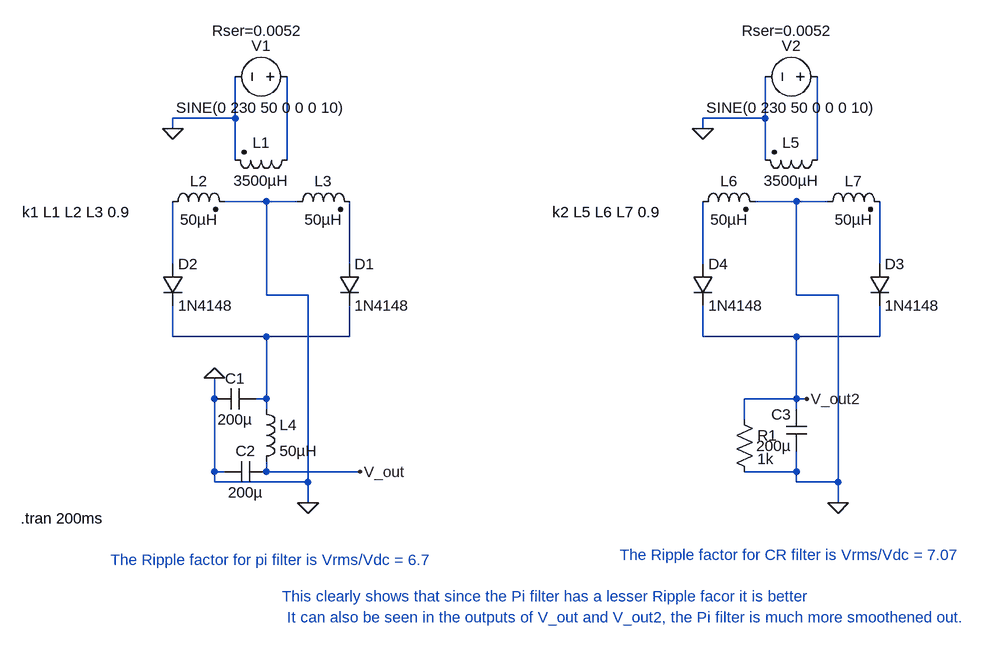
[diagram p0: schematic centertap_fullwave_rectifier_2019A3PS0443H.asc]
centertap_fullwave_rectifier_2019A3PS0443H.asc, the LTspice schematic file:
Version 4
SHEET 1 1320 720
WIRE 96 -64 96 -128
WIRE 96 -64 0 -64
WIRE 912 -64 912 -128
WIRE 912 -64 816 -64
WIRE 0 -48 0 -64
WIRE 816 -48 816 -64
WIRE 96 0 96 -64
WIRE 176 0 176 -128
WIRE 912 0 912 -64
WIRE 992 0 992 -128
WIRE 144 64 80 64
WIRE 192 64 144 64
WIRE 960 64 896 64
WIRE 1008 64 960 64
WIRE 0 160 0 64
WIRE 272 160 272 64
WIRE 816 160 816 64
WIRE 1088 160 1088 64
WIRE 144 208 144 64
WIRE 208 208 144 208
WIRE 960 208 960 64
WIRE 1024 208 960 208
WIRE 0 272 0 224
WIRE 144 272 0 272
WIRE 272 272 272 224
WIRE 272 272 144 272
WIRE 816 272 816 224
WIRE 960 272 816 272
WIRE 1088 272 1088 224
WIRE 1088 272 960 272
WIRE 64 368 64 336
WIRE 144 368 144 272
WIRE 144 368 128 368
WIRE 960 368 960 272
WIRE 960 368 880 368
WIRE 976 368 960 368
WIRE 144 384 144 368
WIRE 960 384 960 368
WIRE 880 400 880 368
WIRE 64 480 64 368
WIRE 80 480 64 480
WIRE 144 480 144 464
WIRE 288 480 144 480
WIRE 960 480 960 448
WIRE 960 480 880 480
WIRE 64 496 64 480
WIRE 208 496 208 208
WIRE 208 496 64 496
WIRE 960 496 960 480
WIRE 1024 496 1024 208
WIRE 1024 496 960 496
WIRE 208 528 208 496
WIRE 1024 528 1024 496
FLAG 208 528 0
FLAG 0 -48 0
FLAG 64 336 0
FLAG 288 480 V_out
FLAG 1024 528 0
FLAG 816 -48 0
FLAG 976 368 V_out2
SYMBOL ind2 192 -16 R90
WINDOW 0 5 56 VBottom 2
WINDOW 3 32 56 VTop 2
SYMATTR InstName L1
SYMATTR Value 3500µH
SYMATTR Type ind
SYMBOL ind2 -16 80 R270
WINDOW 0 32 56 VTop 2
WINDOW 3 4 56 VBottom 2
SYMATTR InstName L2
SYMATTR Value 50µH
SYMATTR Type ind
SYMBOL ind2 176 80 R270
WINDOW 0 32 56 VTop 2
WINDOW 3 4 56 VBottom 2
SYMATTR InstName L3
SYMATTR Value 50µH
SYMATTR Type ind
SYMBOL diode 256 160 R0
SYMATTR InstName D1
SYMATTR Value 1N4148
SYMBOL diode -16 160 R0
SYMATTR InstName D2
SYMATTR Value 1N4148
SYMBOL cap 128 352 R90
WINDOW 0 0 32 VBottom 2
WINDOW 3 32 32 VTop 2
SYMATTR InstName C1
SYMATTR Value 200µ
SYMBOL voltage 192 -128 R90
WINDOW 0 -32 56 VBottom 2
WINDOW 3 32 56 VTop 2
WINDOW 123 0 0 Left 0
WINDOW 39 -55 62 VBottom 2
SYMATTR InstName V1
SYMATTR Value SINE(0 230 50 0 0 0 10)
SYMATTR SpiceLine Rser=0.0052
SYMBOL ind 128 368 R0
SYMATTR InstName L4
SYMATTR Value 50µH
SYMBOL cap 144 464 R90
WINDOW 0 0 32 VBottom 2
WINDOW 3 32 32 VTop 2
SYMATTR InstName C2
SYMATTR Value 200µ
SYMBOL ind2 1008 -16 R90
WINDOW 0 5 56 VBottom 2
WINDOW 3 32 56 VTop 2
SYMATTR InstName L5
SYMATTR Value 3500µH
SYMATTR Type ind
SYMBOL ind2 800 80 R270
WINDOW 0 32 56 VTop 2
WINDOW 3 4 56 VBottom 2
SYMATTR InstName L6
SYMATTR Value 50µH
SYMATTR Type ind
SYMBOL ind2 992 80 R270
WINDOW 0 32 56 VTop 2
WINDOW 3 4 56 VBottom 2
SYMATTR InstName L7
SYMATTR Value 50µH
SYMATTR Type ind
SYMBOL diode 1072 160 R0
SYMATTR InstName D3
SYMATTR Value 1N4148
SYMBOL diode 800 160 R0
SYMATTR InstName D4
SYMATTR Value 1N4148
SYMBOL cap 976 448 R180
WINDOW 0 24 56 Left 2
WINDOW 3 24 8 Left 2
SYMATTR InstName C3
SYMATTR Value 200µ
SYMBOL voltage 1008 -128 R90
WINDOW 0 -32 56 VBottom 2
WINDOW 3 32 56 VTop 2
WINDOW 123 0 0 Left 0
WINDOW 39 -55 62 VBottom 2
SYMATTR InstName V2
SYMATTR Value SINE(0 230 50 0 0 0 10)
SYMATTR SpiceLine Rser=0.0052
SYMBOL res 864 384 R0
SYMATTR InstName R1
SYMATTR Value 1k
TEXT -232 80 Left 2 !k1 L1 L2 L3 0.9
TEXT -234 552 Left 2 !.tran 200ms
TEXT 584 80 Left 2 !k2 L5 L6 L7 0.9
TEXT -96 616 Left 2 ;The Ripple factor for pi filter is Vrms/Vdc = 6.7
TEXT 688 608 Left 2 ;The Ripple factor for CR filter is Vrms/Vdc = 7.07
TEXT 168 672 Left 2 ;This clearly shows that since the Pi filter has a lesser Ripple facor it is better
TEXT 176 704 Left 2 ;It can also be seen in the outputs of V_out and V_out2, the Pi filter is much more smoothened out.

The netlist it stands for:
* centertap_fullwave_rectifier_2019A3PS0443H.asc
L1 N001 0 3500µH
L2 N003 0 50µH
L3 0 N004 50µH
D1 N004 N007 1N4148
D2 N003 N007 1N4148
C1 N007 0 200µ
V1 N001 0 SINE(0 230 50 0 0 0 10) Rser=0.0052
L4 N007 V_out 50µH
C2 V_out 0 200µ
L5 N002 0 3500µH
L6 N005 0 50µH
L7 0 N006 50µH
D3 N006 V_out2 1N4148
D4 N005 V_out2 1N4148
C3 0 V_out2 200µ
V2 N002 0 SINE(0 230 50 0 0 0 10) Rser=0.0052
R1 V_out2 0 1k
.model D D
.lib standard.dio
k1 L1 L2 L3 0.9
.tran 200ms
k2 L5 L6 L7 0.9
* The Ripple factor for pi filter is Vrms/Vdc = 6.7
* The Ripple factor for CR filter is Vrms/Vdc = 7.07
* This clearly shows that since the Pi filter has a lesser Ripple facor it is better
* It can also be seen in the outputs of V_out and V_out2, the Pi filter is much more smoothened out.
.backanno
.end